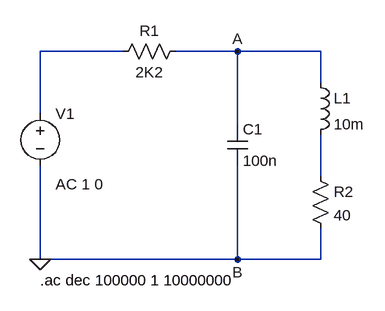
[diagram p0: schematic Circuito_apartadoB.asc]
Circuito_apartadoB.asc, the LTspice schematic file:
Version 4
SHEET 1 880 680
WIRE 48 48 -80 48
WIRE 224 48 128 48
WIRE 352 48 224 48
WIRE 352 96 352 48
WIRE -80 144 -80 48
WIRE 224 160 224 48
WIRE 352 240 352 176
WIRE -80 368 -80 224
WIRE 224 368 224 224
WIRE 224 368 -80 368
WIRE 352 368 352 320
WIRE 352 368 224 368
FLAG 224 48 A
FLAG 224 368 B
FLAG -80 368 0
SYMBOL cap 208 160 R0
SYMATTR InstName C1
SYMATTR Value 100n
SYMBOL ind 336 80 R0
SYMATTR InstName L1
SYMATTR Value 10m
SYMBOL voltage -80 128 R0
WINDOW 3 24 96 Invisible 2
WINDOW 123 24 124 Left 2
WINDOW 39 0 0 Left 2
SYMATTR InstName V1
SYMATTR Value SINE(0)
SYMATTR Value2 AC 1 0
SYMBOL res 144 32 R90
WINDOW 0 0 56 VBottom 2
WINDOW 3 32 56 VTop 2
SYMATTR InstName R1
SYMATTR Value 2K2
SYMBOL res 336 224 R0
SYMATTR InstName R2
SYMATTR Value 40
TEXT -80 400 Left 2 !.ac dec 100000 1 10000000

The netlist it stands for:
* Circuito_apartadoB.asc
C1 A 0 100n
L1 A N002 10m
V1 N001 0 SINE(0) AC 1 0
R1 A N001 2K2
R2 N002 0 40
.ac dec 100000 1 10000000
.backanno
.end